# EAGLE schematic espnative-deadrail-2-8 (EAGLE 7.6.0)
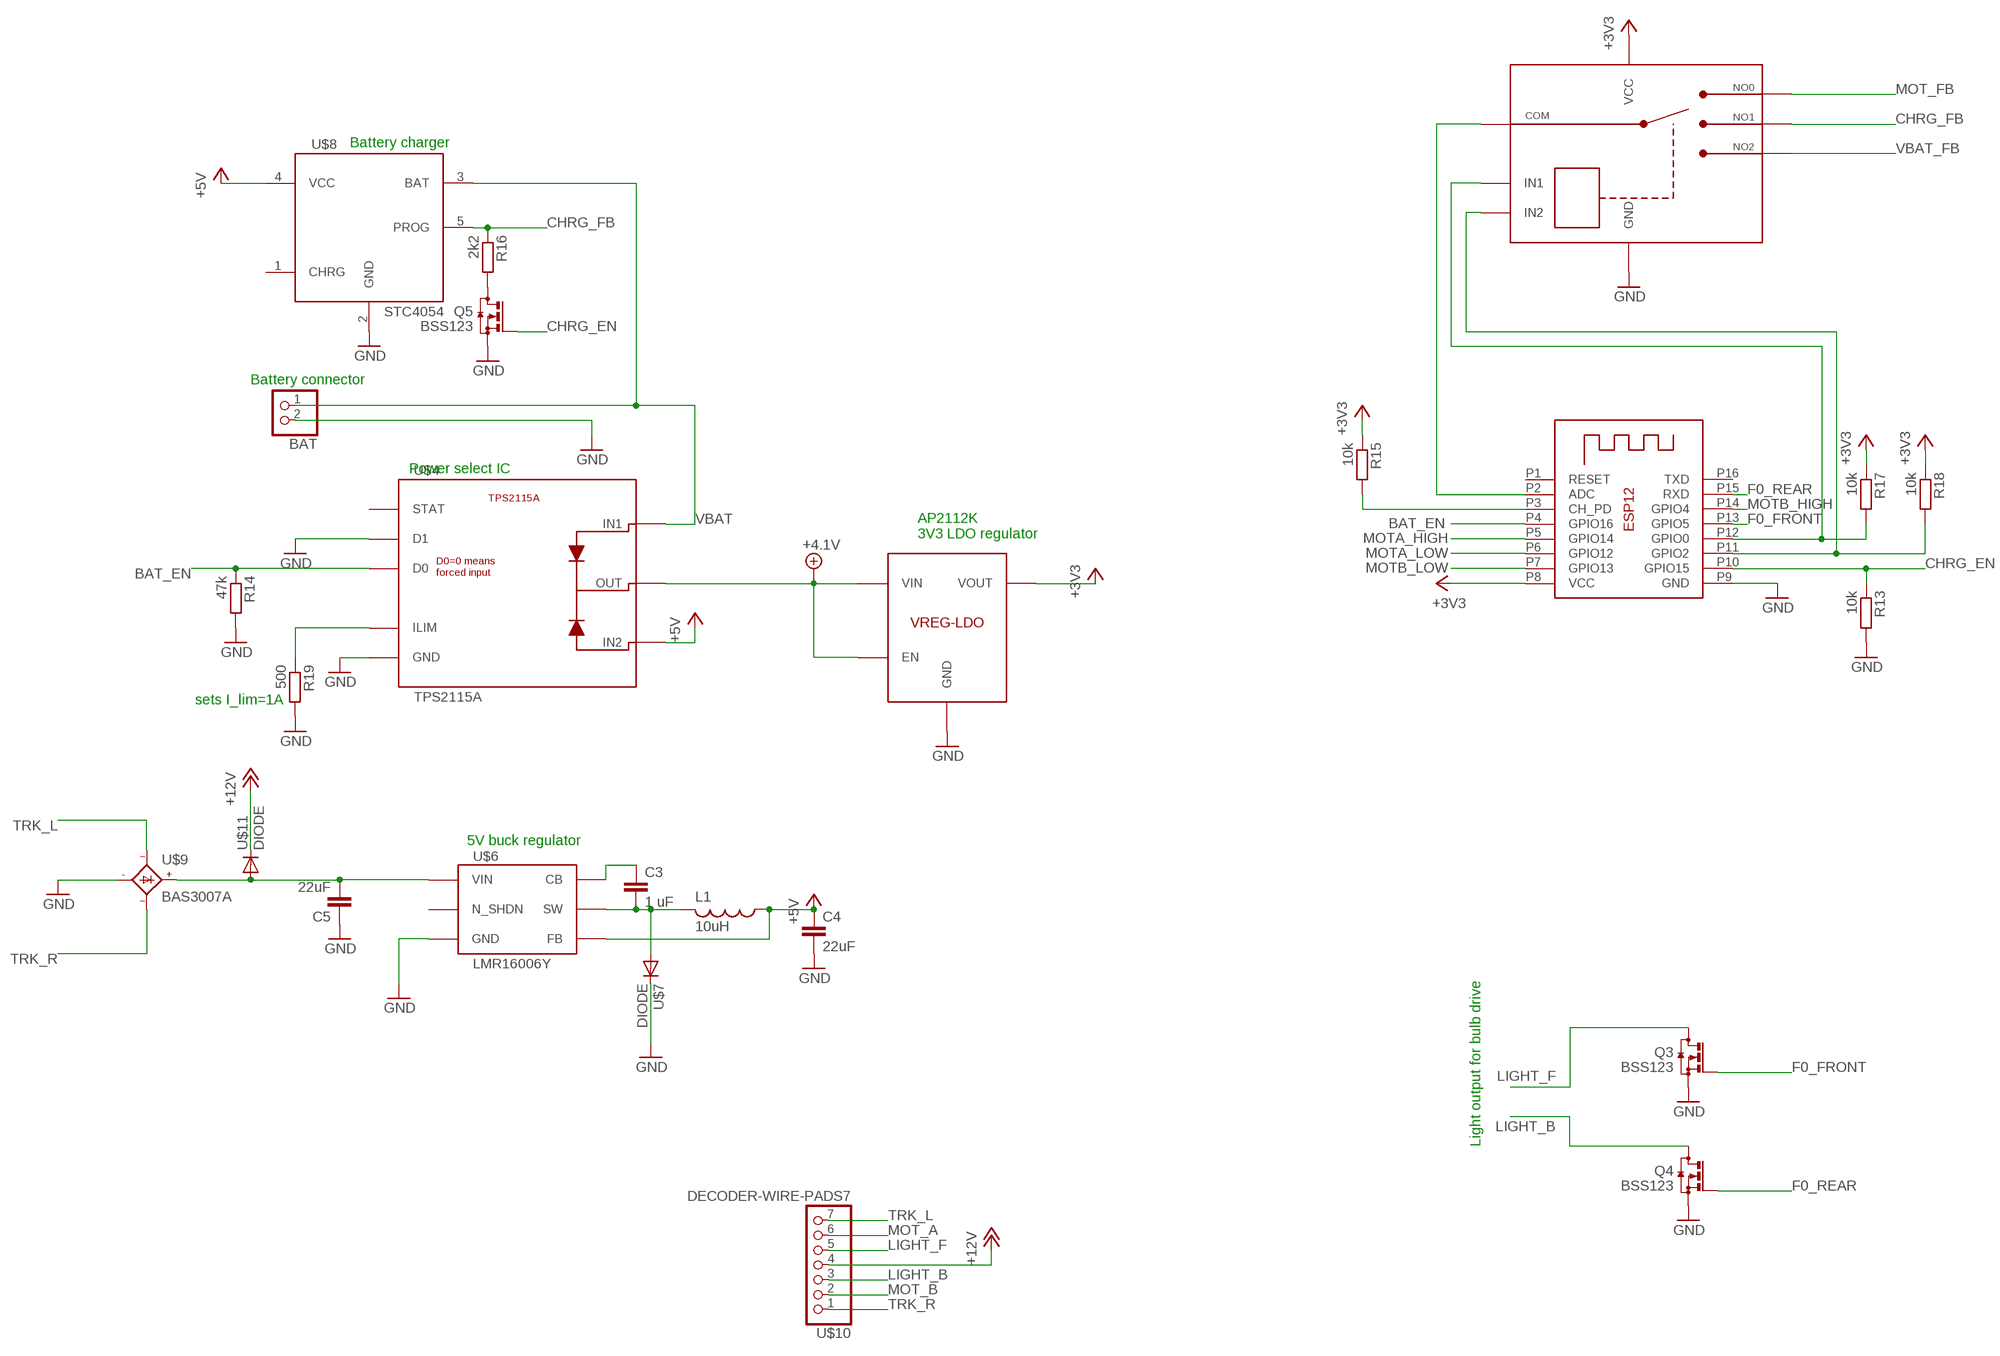
[diagram p0: schematic, sheet 1, part 1 of 2]
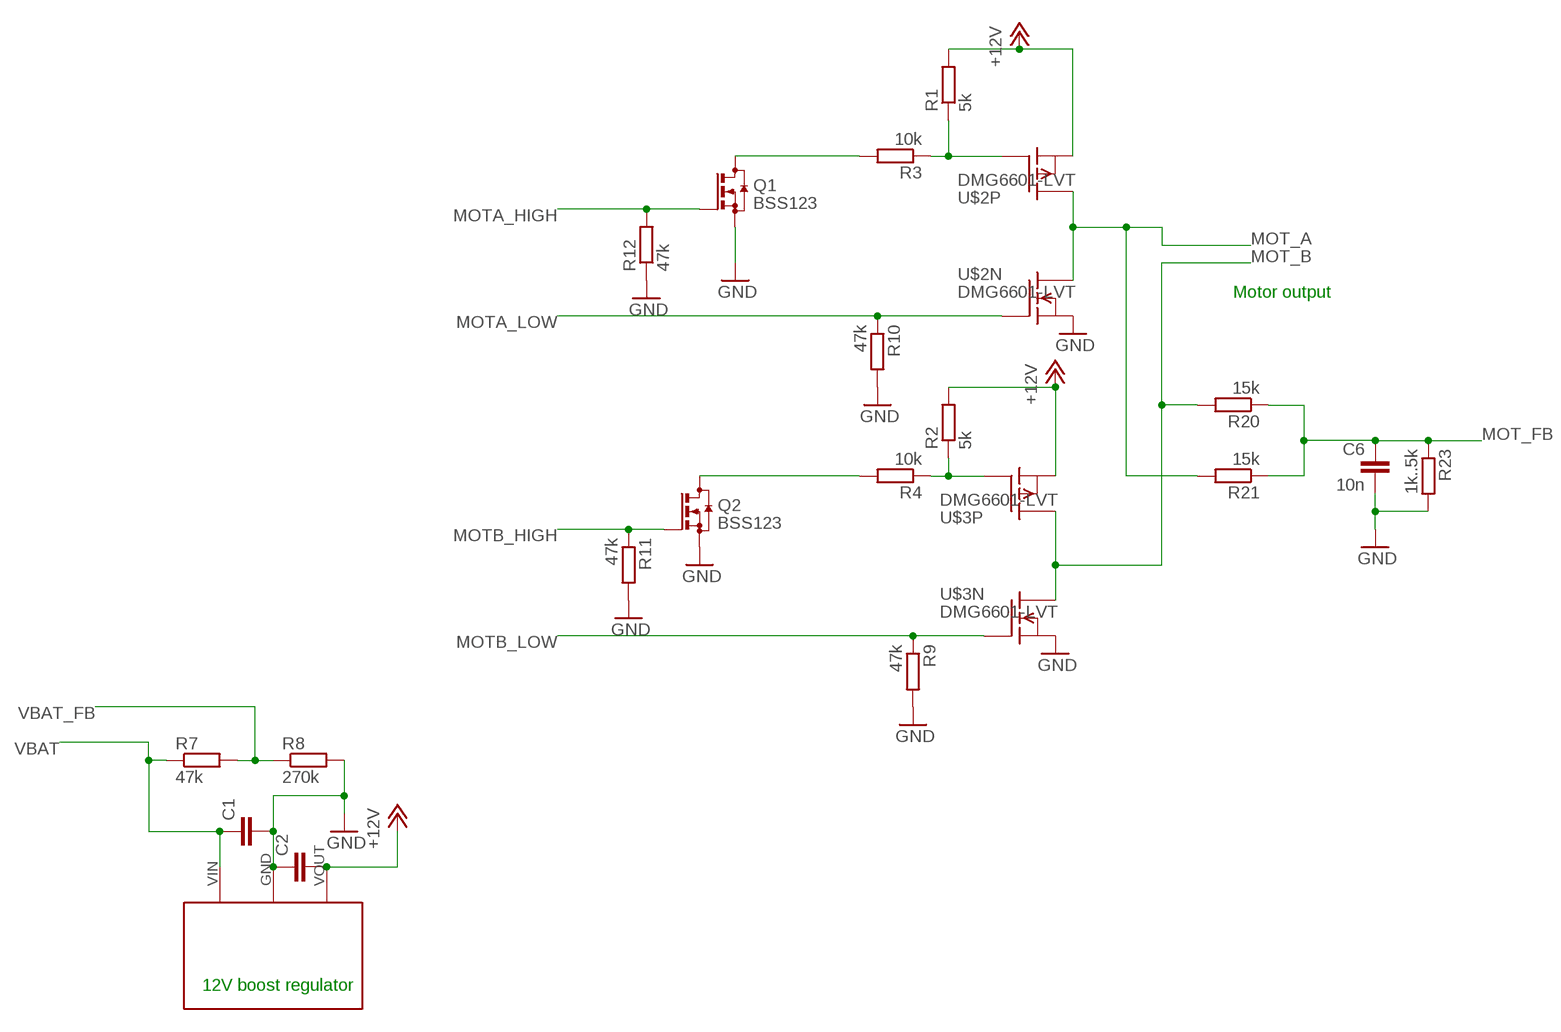
[diagram p1: schematic, sheet 1, part 2 of 2]

## Parts
BAT  JST_2PIN-SMT-RA  [JST-PH-2-SMT-RA]
C1  C-EUC1206  [C1206]
C2  C-EUC1206  [C1206]
C3  1 uF  C-EUC0603  [C0603]
C4  22uF  C-EUC0603  [C0603]
C5  22uF  C-EUC1206  [C1206]
C6  10n  C-EUC0603  [C0603]
L1  10uH  FDSD0420  [FDSD0420]
Q1  BSS123  [SOT23]
Q2  BSS123  [SOT23]
Q3  BSS123  [SOT23]
Q4  BSS123  [SOT23]
Q5  BSS123  [SOT23]
R1  5k  R-EU_R0603  [R0603]
R2  5k  R-EU_R0603  [R0603]
R3  10k  R-EU_R0603  [R0603]
R4  10k  R-EU_R0603  [R0603]
R7  47k  R-EU_R0603  [R0603]
R8  270k  R-EU_R0603  [R0603]
R9  47k  R-EU_R0603  [R0603]
R10  47k  R-EU_R0603  [R0603]
R11  47k  R-EU_R0603  [R0603]
R12  47k  R-EU_R0603  [R0603]
R13  10k  R-EU_R0603  [R0603]
R14  47k  R-EU_R0603  [R0603]
R15  10k  R-EU_R0603  [R0603]
R16  2k2  R-EU_R0603  [R0603]
R17  10k  R-EU_R0603  [R0603]
R18  10k  R-EU_R0603  [R0603]
R19  500  R-EU_R0603  [R0603]
R20  15k  R-EU_R0603  [R0603]
R21  15k  R-EU_R0603  [R0603]
R23  1k..5k  R-EU_R0603  [R0603]
U$1  AP2112K-3V3  AP2112K  [SOT23-5L]
U$2  DMG6601-LVT  [TSOT-26]
U$3  DMG6601-LVT  [TSOT-26]
U$4  TPS2115A  [TSSOP-8]
U$5  POLOLU-VREG12  [POLOLU-REGULATOR]
U$6  LMR16006Y  [SOT23-6]
U$7  DIODE  [DIODE-1206]
U$8  STC4054  [SOT23-5L]
U$9  BAS3007A  [SOT143B]
U$10  DECODER-WIRE-PADS7  [DECODER-WIRE-PADS]
U$11  DIODE  [DIODE-1206]
U$12  TS5A3359  [US8]
X1  ESP-12-TH  [ESP-12-TH]

## Nets
+3V3: R15.1 R17.1 R18.1 U$1.5(VOUT) U$12.8(VCC) X1.P8(VCC)
+4.1V: U$1.1(VIN) U$1.3(EN) U$4.7(OUT)
+5V: C4.1 L1.P$1 U$4.6(IN2) U$6.3(FB) U$8.4(VCC)
+12V: C2.2 R1.2 R2.2 U$2.2(P:S) U$3.2(P:S) U$5.VOUT U$10.4 U$11.C
BAT_EN: R14.1 U$4.2(D0) X1.P4(GPIO16)
CHRG_EN: Q5.1(G) R13.1 X1.P10(GPIO15)
CHRG_FB: R16.1 U$8.5(PROG) U$12.2(NO1)
DCC_VPLUS: C5.2 U$6.5(VIN) U$9.4(+) U$11.A
F0_FRONT: Q3.1(G) X1.P13(GPIO5)
F0_REAR: Q4.1(G) X1.P15(RXD)
GND: BAT.2 C1.2 C2.1 C4.2 C5.1 C6.2 Q1.2(S) Q2.2(S) Q3.2(S) Q4.2(S) Q5.2(S) R8.2 R9.2 R10.2 R11.2 R12.1 R13.2 R14.2 R19.2 R23.2 U$1.2(GND) U$2.5(N:S) U$3.5(N:S) U$4.3(D1) U$4.5(GND) U$5.GND U$6.2(GND) U$7.C U$8.2(GND) U$9.1(-) U$12.4(GND) X1.P9(GND)
LIGHT_B: Q4.3(D) U$10.3
LIGHT_F: Q3.3(D) U$10.5
MOT_A: R21.2 U$2.4(P:D) U$2.6(N:D) U$10.6
MOT_B: R20.2 U$3.4(P:D) U$3.6(N:D) U$10.2
MOT_FB: C6.1 R20.1 R21.1 R23.1 U$12.1(NO0)
MOTA_HIGH: Q1.1(G) R12.2 X1.P5(GPIO14)
MOTA_LOW: R10.1 U$2.1(N:G) X1.P6(GPIO12)
MOTB_HIGH: Q2.1(G) R11.1 X1.P14(GPIO4)
MOTB_LOW: R9.1 U$3.1(N:G) X1.P7(GPIO13)
N$1: U$12.7(COM) X1.P2(ADC)
N$2: R1.1 R3.1 U$2.3(P:G)
N$3: Q2.3(D) R4.2
N$4: R2.1 R4.1 U$3.3(P:G)
N$5: C3.2 L1.P$2 U$6.6(SW) U$7.A
N$6: Q1.3(D) R3.2
N$8: C3.1 U$6.1(CB)
N$11: Q5.3(D) R16.2
N$12: R17.2 U$12.6(IN1) X1.P12(GPIO0)
N$17: R15.2 X1.P3(CH_PD)
N$20: R18.2 U$12.5(IN2) X1.P11(GPIO2)
N$22: R19.1 U$4.4(ILIM)
TRK_L: U$9.2(AC1) U$10.7
TRK_R: U$9.3(AC2) U$10.1
VBAT: BAT.1 C1.1 R7.1 U$4.8(IN1) U$5.VIN U$8.3(BAT)
VBAT_FB: R7.2 R8.1 U$12.3(NO2)
Unconnected: U$4.1(STAT) U$6.4(N_SHDN) U$8.1(CHRG) X1.P1(RESET) X1.P16(TXD)

## Notes on the sheet
- Battery charger
- Battery connector
- Power select IC
- AP2112K
  3V3 LDO regulator
- Motor output
- sets I_lim=1A
- 5V buck regulator
- Light output for bulb drive
- 12V boost regulator

## Library data of the parts
BAT = adafruit:JST_2PIN: JST 2-Pin Connectors of various flavors SMT-RA (S2B-PH-SM4) 4UConnector #17311 SMT (B2B-PH-SM4) THM-RA (S2B-PH) THM (B2B-PH)
C1-C6 = rcl:C-EU: CAPACITOR, European symbol
L1 = trainlib:FDSD0420
Q1-Q5 = transistor-small-signal:BSS123: N-CHANNEL MOS FET
R1-R4 R7-R21 R23 = rcl:R-EU_: RESISTOR, European symbol
U$1 = trainlib:AP2112: 600mA CMOS LDO regulator with enable http://www.diodes.com/_files/datasheets/AP2112.pdf http://www.digikey.com/product-detail/en/diodes-incorporated/AP2112K-3.3TRG1/AP2112K-3.3TRG1DICT-ND/4505257 Package includes sot23-5.
U$2 U$3 = trainlib:DMG6601-LVT: Dual N+P-channel MOSFET. Package: TSOT-26 Vmax=30V N-channel: 55mOhm, 3.8A Imax P-channel: 110mOhm, 2.5A Imax
U$4 = trainlib:TPS2115A: Power source select Ideal diode pair selects power source from two alternatives. Truth table: D0=0 selects fixed input. (D1=0 sleects IN2, D1=1 selects IN1) D0=1 selects auto-input. (D1=0 picks higher voltage, D1=1 sets shutdown) http://www.ti.com/lit/ds/symlink/tps2114a.pdf
U$5 = trainlib:POLOLU-VREG12
U$6 = trainlib:LMR16006Y: Buck regulator with 600mA output current and 2.1MHz fixed frequency. http://www.ti.com/lit/ds/symlink/lmr16006y-q1.pdf Available in sot23-6 package.
U$7 U$11 = trainlib:DIODE
U$8 = trainlib:STC4054: Single-cell Li-ion battery charger Configurable maximum current Lithium battery charger. The maximum charging current can be configured with a resistor, up to 800 mA. Charge can be enabled or inhibited. http://www.st.com/content/ccc/resource/technical/document/datasheet/df/b9/e6/5b/ec/92/45/ed/CD00132951.pdf/files/CD00132951.pdf/jcr:content/translations/en.CD00132951.pdf
U$9 = trainlib:BAS3007A: Bridge rectifier 30V typical voltage loss 0.5V, current capability up to 0.9A datasheet link <http://www.infineon.com/dgdl/bas3007aseries.pdf?folderId=db3a304313d846880113def5812204a1&fileId=db3a3043156fd5730115a286aa19083b>
U$10 = trainlib:DECODER-WIRE-PADS7
U$12 = trainlib:TS5A3359: SP3T analog mux 1-Ohm 3-way multiplexer, controlled by two input lines. http://www.ti.com/lit/ds/symlink/ts5a3359.pdf
X1 = trainlib:ESP-12-TH